# Altium schematic sheet Sheet1.SchDoc
size A4; SheetNumber: 1; SheetTotal: 2
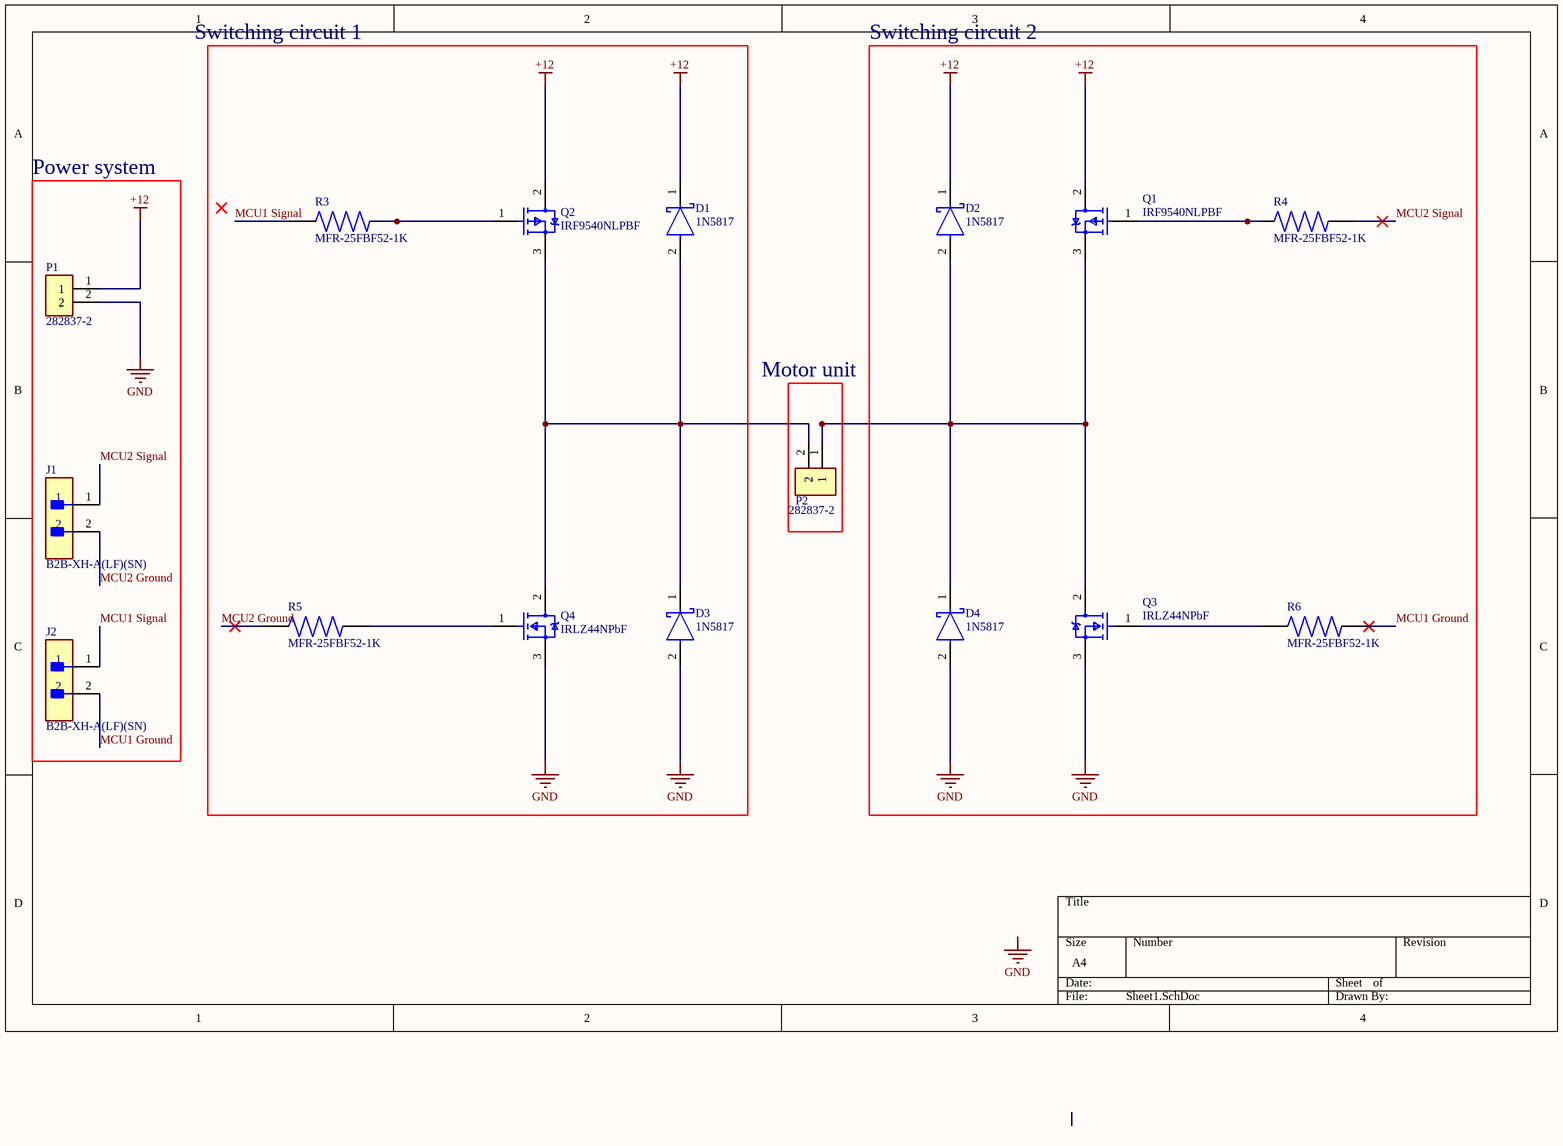
[diagram p0: Sheet1.SchDoc]

## Parts
D1  1N5817  [FP-DO-41-MFG]
D2  1N5817  [FP-DO-41-MFG]
D3  1N5817  [FP-DO-41-MFG]
D4  1N5817  [FP-DO-41-MFG]
J1  B2B-XH-A(LF)(SN)  [FP-B2B-XH-A_LF_SN-MFG]
J2  B2B-XH-A(LF)(SN)  [FP-B2B-XH-A_LF_SN-MFG]
P1  282837-2  [TE_282837-2]
P2  282837-2  [TE_282837-2]
Q1  IRF9540NLPBF  [FP-PG-TO262-3-MFG]
Q2  IRF9540NLPBF  [FP-PG-TO262-3-MFG]
Q3  IRLZ44NPbF  [FP-PG-TO220-3-MFG]
Q4  IRLZ44NPbF  [FP-PG-TO220-3-MFG]
R3  MFR-25FBF52-1K  [RESAD1100W55L680D260]
R4  MFR-25FBF52-1K  [RESAD1100W55L680D260]
R5  MFR-25FBF52-1K  [RESAD1100W55L680D260]
R6  MFR-25FBF52-1K  [RESAD1100W55L680D260]

## Blocks framed on the sheet
Switching circuit 2: D2 D4 Q1 Q3 R4 R6
Power system: J1 J2 P1

## Nets
+12: D1.1(C) D2.1(C) P1.1 Q1.2(Drain) Q2.2(Drain)
GND: D3.2(A) D4.2(A) P1.2 Q3.3(S) Q4.3(S)
MCU1 Ground: J2.2 R6.2
MCU1 Signal: J2.1 R3.1
MCU2 Ground: J1.2 R5.1
MCU2 Signal: J1.1 R4.2
NetD1_2: D1.2(A) D3.1(C) P2.2 Q2.3(Source) Q4.2(D)
NetD2_2: D2.2(A) D4.1(C) P2.1 Q1.3(Source) Q3.2(D)
NetQ1_1: Q1.1(Gate) R4.1
NetQ2_1: Q2.1(Gate) R3.2
NetQ3_1: Q3.1(G) R6.1
NetQ4_1: Q4.1(G) R5.2

## Notes on the sheet
- Switching circuit 1
- Motor unit
- Labels drawn without touching a wire or pin: GND

## Library data of the parts
D1-D4 = CMP-12187-000037-1: DIODE SCHOTTKY 20V 1A DO41; Max Forward Surge Current (Ifsm): 25A; Forward Voltage: 450mV; Max Reverse Leakage Current: 500uA; Element Configuration: Single; Polarity: Standard; Capacitance: 110pF; Length: 5.2mm; Min Operating Temperature: -65°C; Series: -; Packaging: Cut Tape; Output Current: 1A; RoHS Compliant: Yes; Max Surge Current: 25A; Voltage Rating (DC): 20V; Number of Pins: 2; Width: 2.7mm; Max Reverse Voltage (DC): 20V; Height: 2.7mm; Weight: 0.01lb; Max Operating Temperature: 150°C; Current Rating: 1A; Lead Free: Lead Free; Case/Package: DO-41; Radiation Hardening: No; Package Quantity: 2000; Forward Current: 1A; Max Repetitive Reverse Voltage (Vrrm): 20V; Peak Non-Repetitive Surge Current: 25A; REACH SVHC: No SVHC; Average Rectified Current: 1A; Max Reverse Current: 500uA; Mount: Through Hole
J1 J2 = CMP-2000-05888-3: CONN HEADER VERT 2POS 2.5MM; Current Rating: 3A; Voltage Rating: 250V; Number of Contacts: 2; Contact Resistance: 20mR; Wire/Cable Gauge: 22AWG; Insulation Resistance: 1GR; Connector Type: Male Pin; Packaging: Bulk; Contact Material: Brass; Lead Free: Lead Free; Orientation: Straight; Contact Plating: Tin; Max Current Rating: 3A; Termination: Solder; Fastening Type: Detent; Depth: 5.75mm; Housing Material: Polyamide; REACH SVHC: No SVHC; Series: XH; Voltage Rating (AC): 250V; Number of Positions: 2; Color: Natural; Contact Type: Male Pin; Max Voltage Rating (DC): 250V; Pitch: 2.5mm; Lead Pitch: 2.5mm; Mount: Through Hole; Max Operating Temperature: 85°C; Length: 7.4mm; Max Voltage Rating (AC): 250V; Min Operating Temperature: -25°C; Number of Rows: 1; Housing Color: White
P1 P2 = 282837-2: Ð Ð°Ð·ÑŠÐµÐ¼Ð½Ñ‹Ðµ ÐºÐ»ÐµÐ¼Ð¼Ð½Ñ‹Ðµ ÐºÐ¾Ð»Ð¾Ð´ÐºÐ¸ Ð Ð¾Ð·ÐµÑ‚ÐºÐ° 2 Ð¿Ð¾Ð»Ð¾Ð¶ÐµÐ½Ð¸Ñ 5,08 Ð¼Ð¼ ÐŸÑ€Ð¸Ð¿Ð¾Ð¹ Ð¿Ñ€ÑÐ¼Ð¾Ð¹ Ñ‡ÐµÑ€ÐµÐ· Ð¾Ñ‚Ð²ÐµÑ€ÑÑ‚Ð¸Ðµ 13,5 Ð / ÐºÐ¾Ð½Ñ‚Ð°ÐºÑ‚; MF: TE Connectivity; SnapEDA_Link: https://www.snapeda.com/parts/282837-2/TE+Connectivity+AMP+Connectors/view-part/?ref=snap; Price: None; Check_prices: https://www.snapeda.com/parts/282837-2/TE+Connectivity+AMP+Connectors/view-part/?ref=eda; Purchase-URL: https://pricing.snapeda.com/search/part/282837-2/?ref=eda; MP: 282837-2; Value: *; Availability: In Stock; Package: None
Q1 Q2 = CMP-32901-000518-1: MOSFET P-CH 100V 23A TO262-3; Number of Channels: 1; Max Dual Supply Voltage: -100V; Rise Time: 67ns; Max Power Dissipation: 3.1W; Gate to Source Voltage (Vgs): 20V; Drain to Source Resistance: 117mR; Turn-On Delay Time: 13ns; Turn-Off Delay Time: 40ns; Threshold Voltage: 4V; Input Capacitance: 1.45nF; Power Dissipation: 110W; Length: 0.42inch; Max Operating Temperature: 150°C; Case/Package: TO-262; Packaging: Rail/Tube; Height: 0.38inch; Drain to Source Voltage (Vdss): -100V; Lead Free: Contains Lead; Rds On Max: 117mR; Width: 0.19inch; Min Operating Temperature: -55°C; RoHS Compliant: Yes; Mount: Through Hole; Continuous Drain Current (ID): 23A; Number of Pins: 3; Halogen Free: Not Halogen Free; REACH SVHC: No SVHC
Q3 Q4 = CMP-32901-000488-1: MOSFET N-CH 55V 47A TO220AB; Turn-On Delay Time: 11ns; Gate to Source Voltage (Vgs): 16V; Element Configuration: Single; Rds On Max: 22mR; Turn-Off Delay Time: 26ns; Max Power Dissipation: 110W; Threshold Voltage: 2V; Drain to Source Resistance: 35mR; Input Capacitance: 1.7nF; Continuous Drain Current (ID): 47A; Case/Package: TO-220; Lead Free: Lead Free; Halogen Free: Halogen Free; Packaging: Rail/Tube; Length: 0.414inch; Min Operating Temperature: -55°C; REACH SVHC: No SVHC; Number of Pins: 3; Width: 0.185inch; Drain to Source Voltage (Vdss): 55V; Power Dissipation: 110W; RoHS Compliant: Yes; Max Operating Temperature: 175°C; Height: 0.6inch; Max Dual Supply Voltage: 55V; Drain to Source Breakdown Voltage: 55V; Mount: Through Hole
R3-R6 = MFR-25FBF52-10K: 10.2 kOhms Â±1% 0.25W, 1/4W Through Hole Resistor Axial - Metal Film; MF: Yageo; SnapEDA_Link: https://www.snapeda.com/parts/MFR-25FBF52-10K/Yageo/view-part/?ref=snap; Availability: In Stock; Price: None; Value: *; Check_prices: https://www.snapeda.com/parts/MFR-25FBF52-10K/Yageo/view-part/?ref=eda; Purchase-URL: https://pricing.snapeda.com/search/part/MFR-25FBF52-10K/?ref=eda; MP: MFR-25FBF52-10K; Package: Axial Yageo